# EAGLE design DKBLE112 IO Shield v1.0 (EAGLE 6.3)
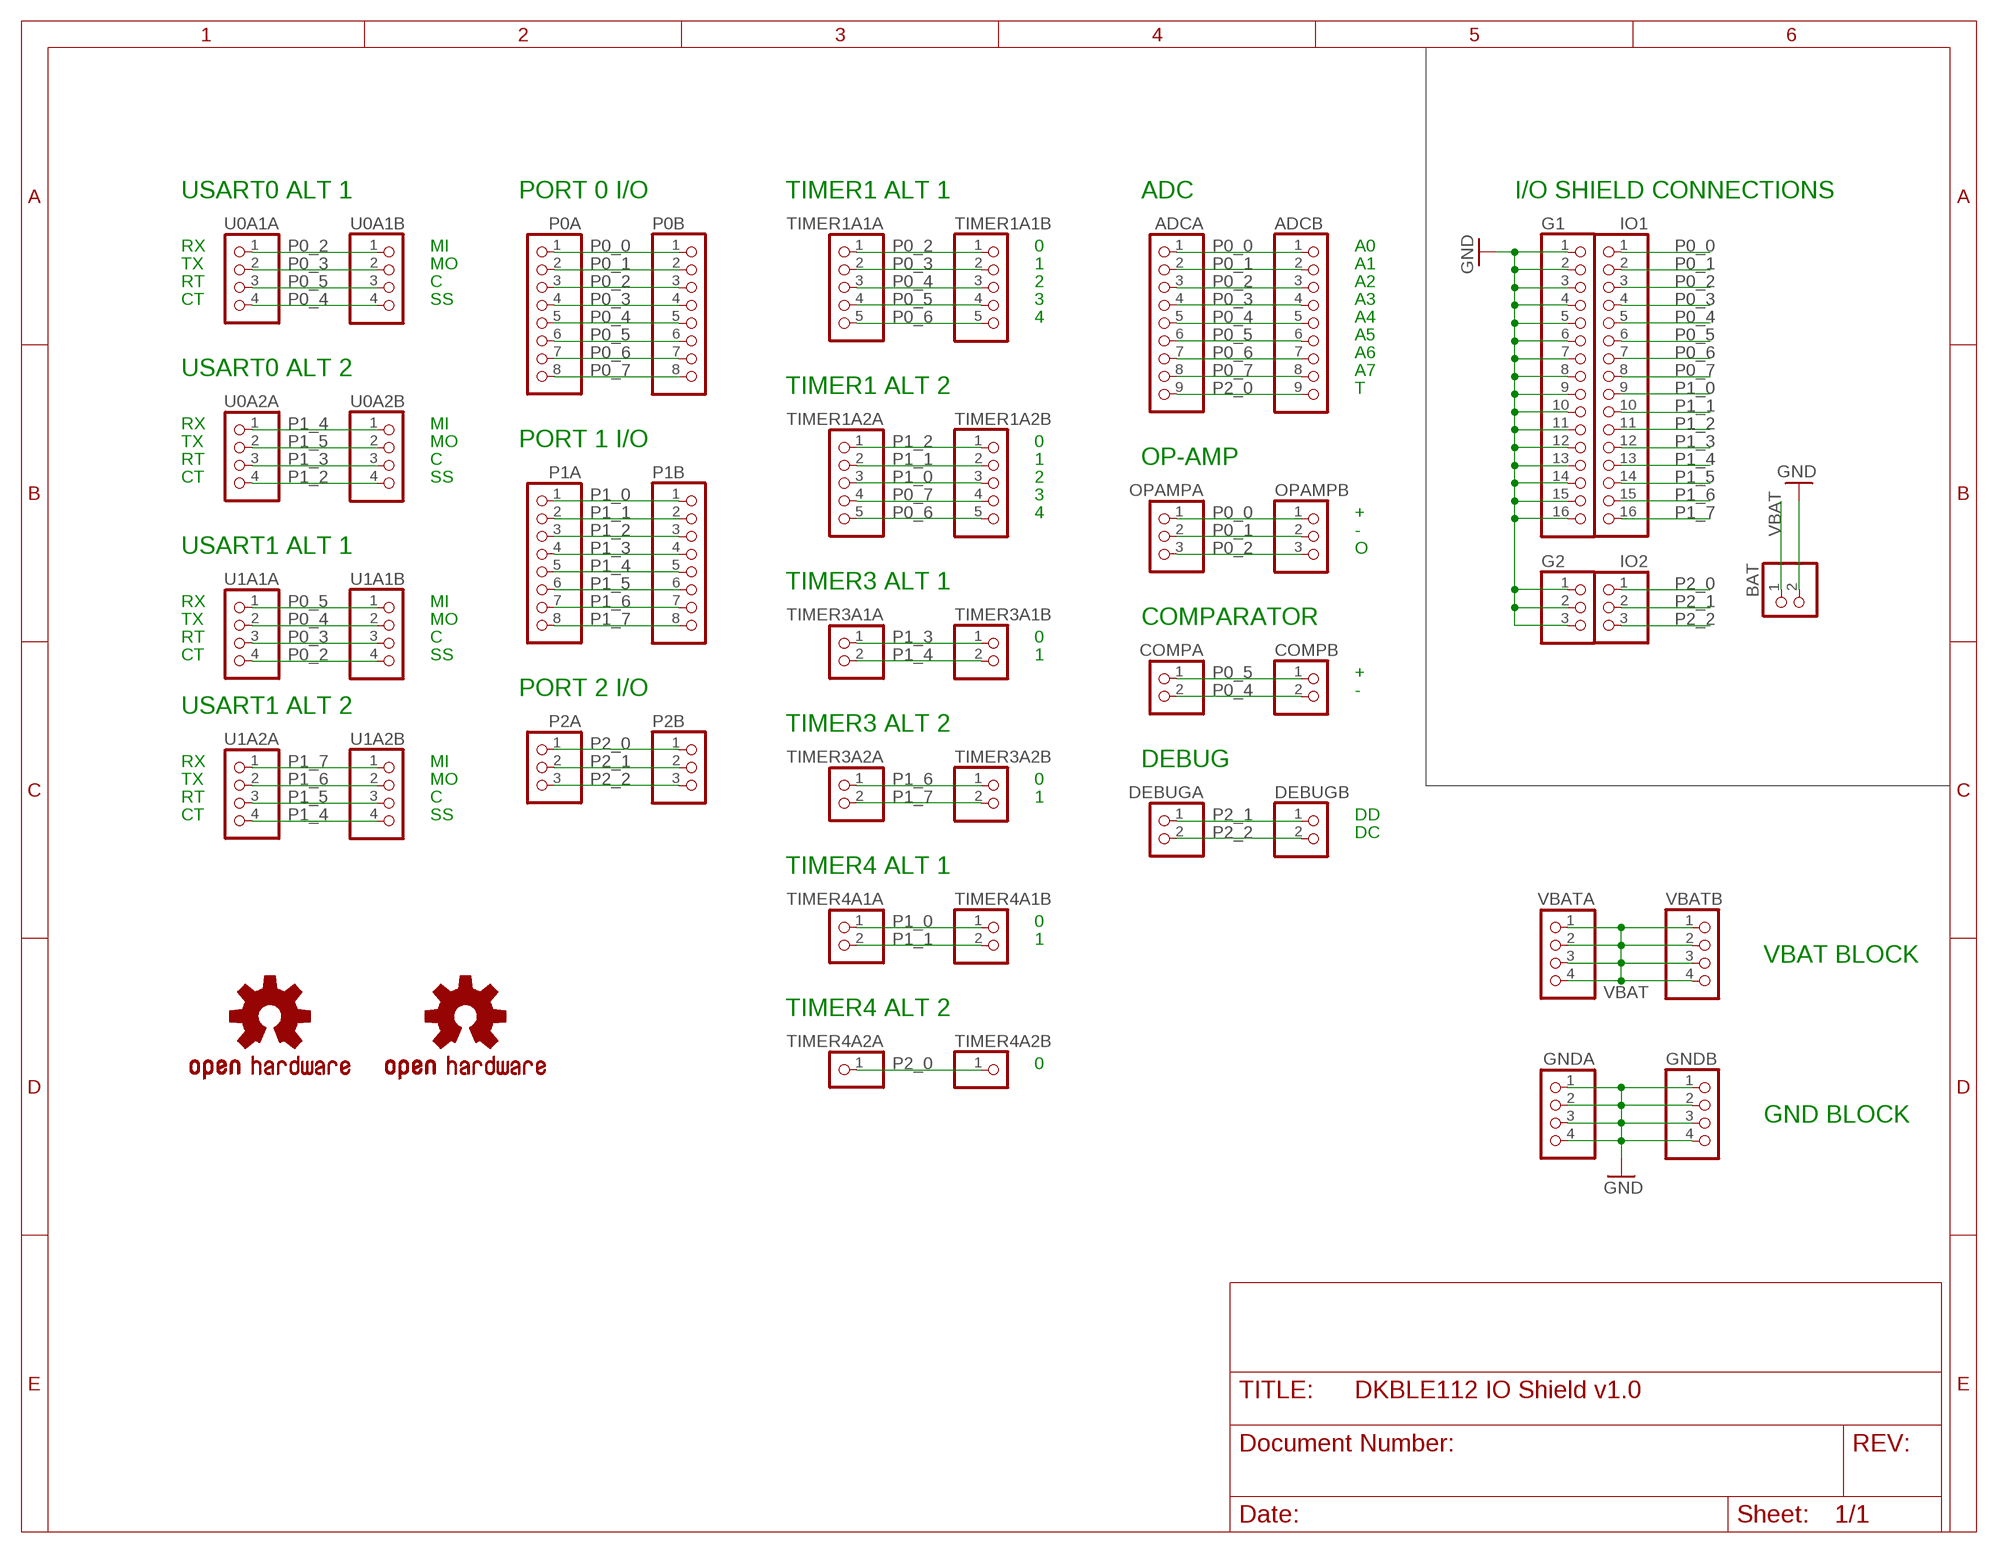
[diagram p0: schematic, sheet 1]

## Parts
ADCA  PINHD-1X9  [1X09]
ADCB  PINHD-1X9  [1X09]
BAT  PINHD-1X2  [1X02]
COMPA  PINHD-1X2  [1X02]
COMPB  PINHD-1X2  [1X02]
DEBUGA  PINHD-1X2  [1X02]
DEBUGB  PINHD-1X2  [1X02]
G1  PINHD-1X16  [1X16]
G2  PINHD-1X3  [1X03]
GNDA  PINHD-1X4  [1X04]
GNDB  PINHD-1X4  [1X04]
IO1  PINHD-1X16  [1X16]
IO2  PINHD-1X3  [1X03]
OPAMPA  PINHD-1X3  [1X03]
OPAMPB  PINHD-1X3  [1X03]
P0A  PINHD-1X8  [1X08]
P0B  PINHD-1X8  [1X08]
P1A  PINHD-1X8  [1X08]
P1B  PINHD-1X8  [1X08]
P2A  PINHD-1X3  [1X03]
P2B  PINHD-1X3  [1X03]
TIMER1A1A  PINHD-1X5  [1X05]
TIMER1A1B  PINHD-1X5  [1X05]
TIMER1A2A  PINHD-1X5  [1X05]
TIMER1A2B  PINHD-1X5  [1X05]
TIMER3A1A  PINHD-1X2  [1X02]
TIMER3A1B  PINHD-1X2  [1X02]
TIMER3A2A  PINHD-1X2  [1X02]
TIMER3A2B  PINHD-1X2  [1X02]
TIMER4A1A  PINHD-1X2  [1X02]
TIMER4A1B  PINHD-1X2  [1X02]
TIMER4A2A  PINHD-1X1  [1X01]
TIMER4A2B  PINHD-1X1  [1X01]
U0A1A  PINHD-1X4  [1X04]
U0A1B  PINHD-1X4  [1X04]
U0A2A  PINHD-1X4  [1X04]
U0A2B  PINHD-1X4  [1X04]
U1A1A  PINHD-1X4  [1X04]
U1A1B  PINHD-1X4  [1X04]
U1A2A  PINHD-1X4  [1X04]
U1A2B  PINHD-1X4  [1X04]
U$1  OSHW-LOGOL  [OSHW-LOGO-L]
U$2  OSHW-LOGOM  [OSHW-LOGO-M]
VBATA  PINHD-1X4  [1X04]
VBATB  PINHD-1X4  [1X04]

## Nets
GND: BAT.2 G1.1 G1.2 G1.3 G1.4 G1.5 G1.6 G1.7 G1.8 G1.9 G1.10 G1.11 G1.12 G1.13 G1.14 G1.15 G1.16 G2.1 G2.2 G2.3 GNDA.1 GNDA.2 GNDA.3 GNDA.4 GNDB.1 GNDB.2 GNDB.3 GNDB.4
P0_0: ADCA.1 ADCB.1 IO1.1 OPAMPA.1 OPAMPB.1 P0A.1 P0B.1
P0_1: ADCA.2 ADCB.2 IO1.2 OPAMPA.2 OPAMPB.2 P0A.2 P0B.2
P0_2: ADCA.3 ADCB.3 IO1.3 OPAMPA.3 OPAMPB.3 P0A.3 P0B.3 TIMER1A1A.1 TIMER1A1B.1 U0A1A.1 U0A1B.1 U1A1A.4 U1A1B.4
P0_3: ADCA.4 ADCB.4 IO1.4 P0A.4 P0B.4 TIMER1A1A.2 TIMER1A1B.2 U0A1A.2 U0A1B.2 U1A1A.3 U1A1B.3
P0_4: ADCA.5 ADCB.5 COMPA.2 COMPB.2 IO1.5 P0A.5 P0B.5 TIMER1A1A.3 TIMER1A1B.3 U0A1A.4 U0A1B.4 U1A1A.2 U1A1B.2
P0_5: ADCA.6 ADCB.6 COMPA.1 COMPB.1 IO1.6 P0A.6 P0B.6 TIMER1A1A.4 TIMER1A1B.4 U0A1A.3 U0A1B.3 U1A1A.1 U1A1B.1
P0_6: ADCA.7 ADCB.7 IO1.7 P0A.7 P0B.7 TIMER1A1A.5 TIMER1A1B.5 TIMER1A2A.5 TIMER1A2B.5
P0_7: ADCA.8 ADCB.8 IO1.8 P0A.8 P0B.8 TIMER1A2A.4 TIMER1A2B.4
P1_0: IO1.9 P1A.1 P1B.1 TIMER1A2A.3 TIMER1A2B.3 TIMER4A1A.1 TIMER4A1B.1
P1_1: IO1.10 P1A.2 P1B.2 TIMER1A2A.2 TIMER1A2B.2 TIMER4A1A.2 TIMER4A1B.2
P1_2: IO1.11 P1A.3 P1B.3 TIMER1A2A.1 TIMER1A2B.1 U0A2A.4 U0A2B.4
P1_3: IO1.12 P1A.4 P1B.4 TIMER3A1A.1 TIMER3A1B.1 U0A2A.3 U0A2B.3
P1_4: IO1.13 P1A.5 P1B.5 TIMER3A1A.2 TIMER3A1B.2 U0A2A.1 U0A2B.1 U1A2A.4 U1A2B.4
P1_5: IO1.14 P1A.6 P1B.6 U0A2A.2 U0A2B.2 U1A2A.3 U1A2B.3
P1_6: IO1.15 P1A.7 P1B.7 TIMER3A2A.1 TIMER3A2B.1 U1A2A.2 U1A2B.2
P1_7: IO1.16 P1A.8 P1B.8 TIMER3A2A.2 TIMER3A2B.2 U1A2A.1 U1A2B.1
P2_0: ADCA.9 ADCB.9 IO2.1 P2A.1 P2B.1 TIMER4A2A.1 TIMER4A2B.1
P2_1: DEBUGA.1 DEBUGB.1 IO2.2 P2A.2 P2B.2
P2_2: DEBUGA.2 DEBUGB.2 IO2.3 P2A.3 P2B.3
VBAT: BAT.1 VBATA.1 VBATA.2 VBATA.3 VBATA.4 VBATB.1 VBATB.2 VBATB.3 VBATB.4

## Notes on the sheet
- USART0 ALT 1 | PORT 0 I/O | TIMER1 ALT 1 | ADC | I/O SHIELD CONNECTIONS
- RX | MI | 0 | A0
- TX | MO | 1 | A1
- RT | C | 2 | A2
- CT | SS | 3 | A3
- 4 | A4
- A5
- A6
- USART0 ALT 2 | A7
- TIMER1 ALT 2 | T
- RX | MI
- TX | MO | PORT 1 I/O | 0
- RT | C | 1 | OP-AMP
- CT | SS | 2
- 3
- 4 | +
- -
- USART1 ALT 1 | O
- TIMER3 ALT 1
- RX | MI
- TX | MO | COMPARATOR
- RT | C | 0
- CT | SS | 1
- +
- PORT 2 I/O | -
- USART1 ALT 2
- TIMER3 ALT 2
- RX | MI | DEBUG
- TX | MO | 0
- RT | C | 1
- CT | SS | DD
- DC
- TIMER4 ALT 1
- 0
- 1
- VBAT BLOCK
- TIMER4 ALT 2
- 0
- GND BLOCK

## Library data of the parts
ADCA ADCB = sf-pinhead:PINHD-1X9: PIN HEADER
BAT COMPA COMPB DEBUGA DEBUGB TIMER3A1A TIMER3A1B TIMER3A2A TIMER3A2B TIMER4A1A TIMER4A1B = sf-pinhead:PINHD-1X2: PIN HEADER
G1 IO1 = sf-pinhead:PINHD-1X16: PIN HEADER
G2 IO2 OPAMPA OPAMPB P2A P2B = sf-pinhead:PINHD-1X3: PIN HEADER
GNDA GNDB U0A1A U0A1B U0A2A U0A2B U1A1A U1A1B U1A2A U1A2B VBATA VBATB = sf-pinhead:PINHD-1X4: PIN HEADER
P0A P0B P1A P1B = sf-pinhead:PINHD-1X8: PIN HEADER
TIMER1A1A TIMER1A1B TIMER1A2A TIMER1A2B = sf-pinhead:PINHD-1X5: PIN HEADER
TIMER4A2A TIMER4A2B = sf-pinhead:PINHD-1X1: PIN HEADER
U$1 U$2 = SparkFun:OSHW-LOGO: Open Source Hardware Logo This logo indicates the piece of hardware it is found on incorporates a OSHW license and/or adheres to the definition of open source hardware found here: http://freedomdefined.org/OSHW

## Board
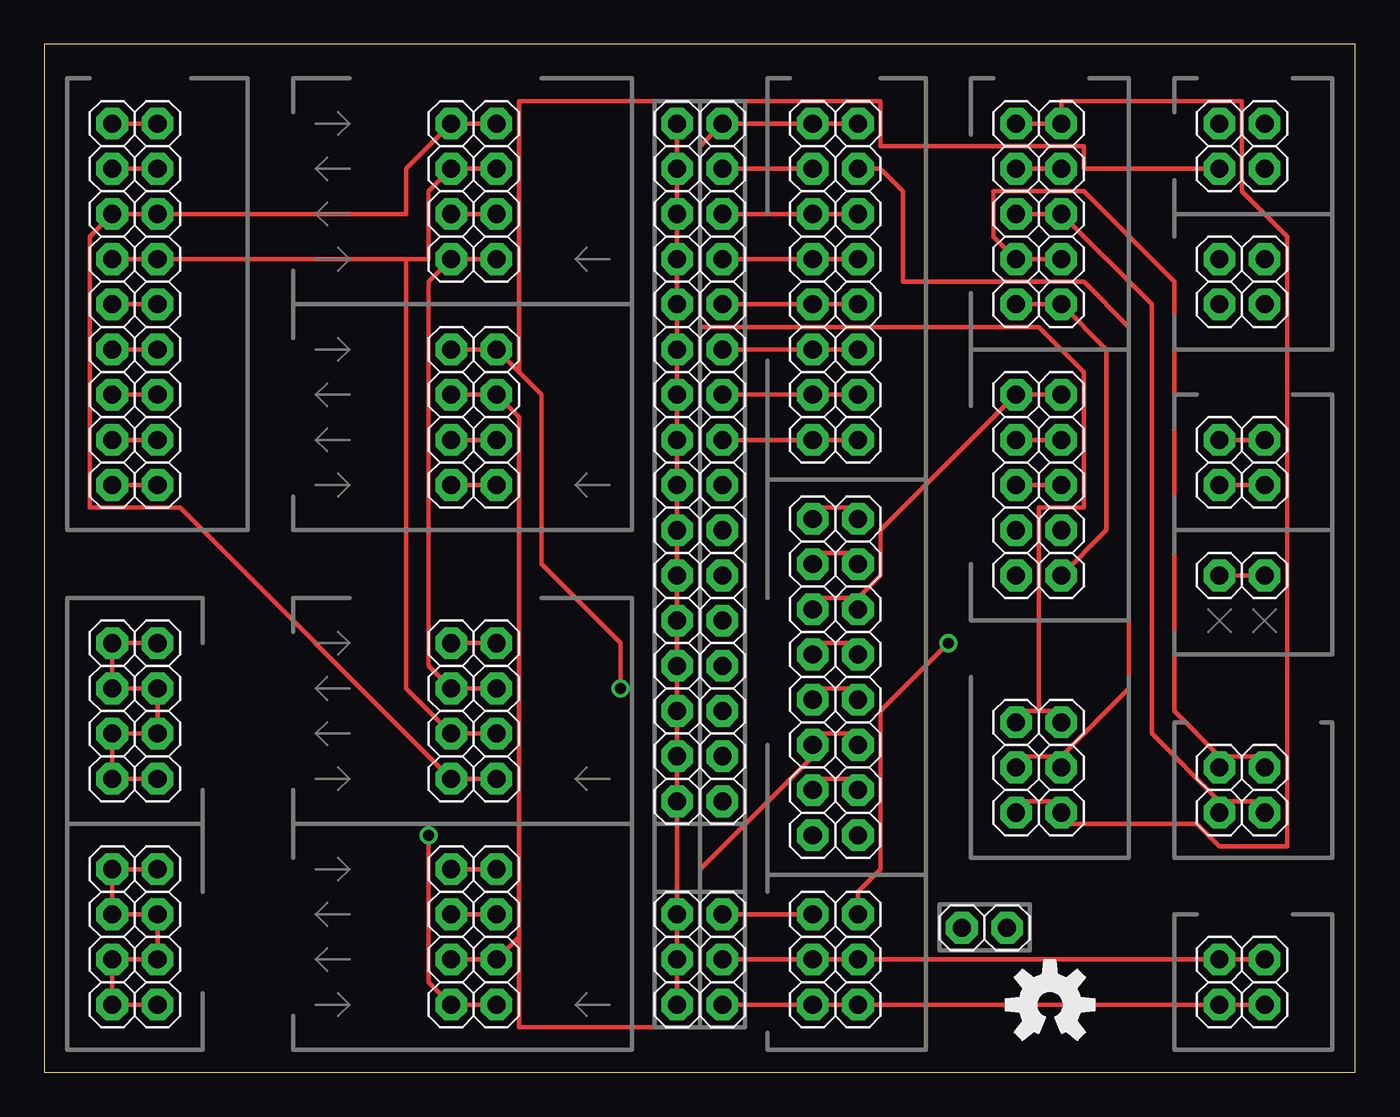
[diagram p1: board, top side]
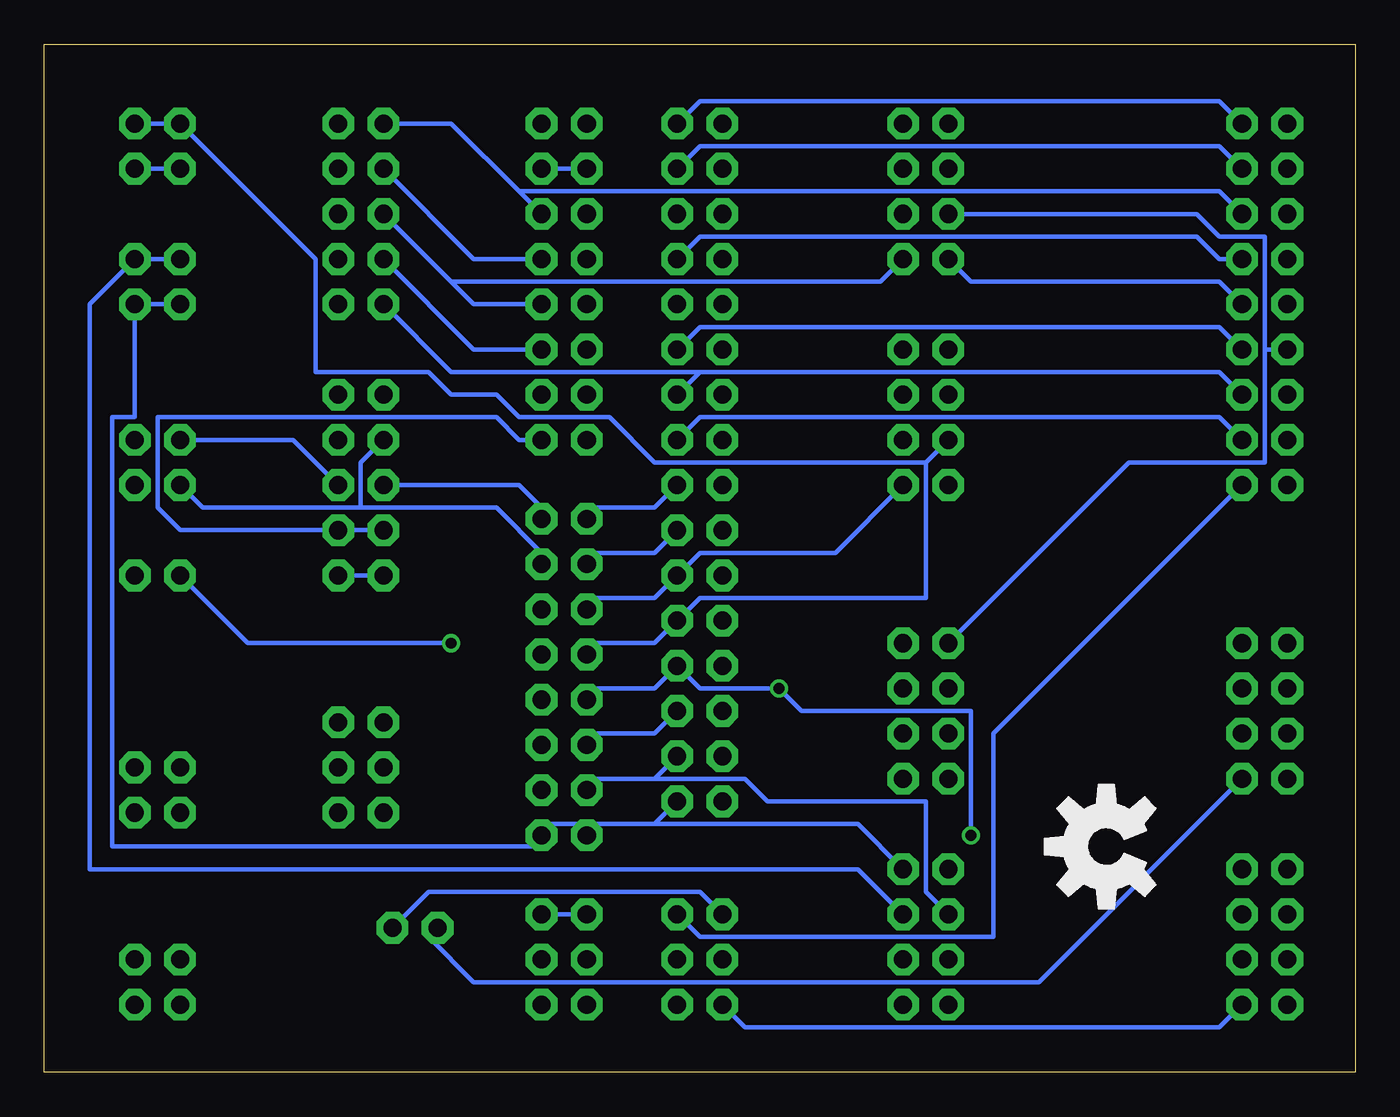
[diagram p2: board, bottom side, seen from below]

Size 73.66 x 57.78 mm. Coordinates in mm from the lower left corner, seen from the top.
Outline: 0,0 73.66,0 73.66,57.78 0,57.78 0,0
Copper layers (1*16): Top 0.035mm / dielectric 1.5mm / Bottom 0.035mm
Design rules "default": minimum track width 10mil, minimum drill 24mil, track to track 8mil, track to pad 8mil, pad to pad 8mil, via to via 8mil, smd to smd 8mil, copper to edge 40mil, drill to drill 8mil, minimum pad ring 10mil, minimum via ring 8mil, stop-mask expansion 4mil, vias tented up to drill 0mil, thermal gap 10mil

### Footprints (pad centres in the part's own frame; a part is rotated, then mirrored left to right if it is on the bottom)
1X09 = drill 1.016 pad 1.778 octagon: 1 -10.16,0; 2 -7.62,0; 3 -5.08,0; 4 -2.54,0; 5 0,0; 6 2.54,0; 7 5.08,0; 8 7.62,0; 9 10.16,0
1X02 = drill 1.016 pad 1.778 octagon: 1 -1.27,0; 2 1.27,0
1X16 = drill 1.016 pad 1.778 octagon: 1 -19.05,0; 2 -16.51,0; 3 -13.97,0; 4 -11.43,0; 5 -8.89,0; 6 -6.35,0; 7 -3.81,0; 8 -1.27,0; 9 1.27,0; 10 3.81,0; 11 6.35,0; 12 8.89,0; 13 11.43,0; 14 13.97,0; 15 16.51,0; 16 19.05,0
1X03 = drill 1.016 pad 1.778 octagon: 1 -2.54,0; 2 0,0; 3 2.54,0
1X04 = drill 1.016 pad 1.778 octagon: 1 -3.81,0; 2 -1.27,0; 3 1.27,0; 4 3.81,0
1X08 = drill 1.016 pad 1.778 octagon: 1 -8.89,0; 2 -6.35,0; 3 -3.81,0; 4 -1.27,0; 5 1.27,0; 6 3.81,0; 7 6.35,0; 8 8.89,0
1X05 = drill 1.016 pad 1.778 octagon: 1 -5.08,0; 2 -2.54,0; 3 0,0; 4 2.54,0; 5 5.08,0
1X01 = drill 1.016 pad 1.778 octagon: 1 0,0

### Placement (x,y rotation side)
ADCA  3.81,43.18 270 top
ADCB  6.35,43.18 270 top
BAT  52.83,8.13 0 top
COMPA  66.04,15.88 270 top
COMPB  68.58,15.88 270 top
DEBUGA  66.04,5.08 270 top
DEBUGB  68.58,5.08 270 top
G1  35.56,34.29 270 top
G2  35.56,6.35 270 top
GNDA  3.81,7.62 90 top
GNDB  6.35,7.62 90 top
IO1  38.1,34.29 270 top
IO2  38.1,6.35 270 top
OPAMPA  54.61,17.14 270 top
OPAMPB  57.15,17.14 270 top
P0A  43.18,44.45 270 top
P0B  45.72,44.45 270 top
P1A  43.18,22.23 270 top
P1B  45.72,22.23 270 top
P2A  43.18,6.35 270 top
P2B  45.72,6.35 270 top
TIMER1A1A  54.61,48.26 270 top
TIMER1A1B  57.15,48.26 270 top
TIMER1A2A  54.61,33.02 270 top
TIMER1A2B  57.15,33.02 270 top
TIMER3A1A  66.04,52.07 270 top
TIMER3A1B  68.58,52.07 270 top
TIMER3A2A  66.04,44.45 270 top
TIMER3A2B  68.58,44.45 270 top
TIMER4A1A  66.04,34.29 270 top
TIMER4A1B  68.58,34.29 270 top
TIMER4A2A  66.04,27.94 90 top
TIMER4A2B  68.58,27.94 90 top
U0A1A  25.4,49.53 270 top
U0A1B  22.86,49.53 270 top
U0A2A  25.4,36.83 270 top
U0A2B  22.86,36.83 270 top
U1A1A  25.4,20.32 270 top
U1A1B  22.86,20.32 270 top
U1A2A  25.4,7.62 270 top
U1A2B  22.86,7.62 270 top
U$1  13.97,12.7 90 bottom
U$2  56.52,3.81 0 top
VBATA  3.81,20.32 90 top
VBATB  6.35,20.32 90 top

### Tracks (layer width: path | path; a pad name or v marks a point on that pad's centre or on a via)
GND
  Top 0.254: G1.1 G1.2 G1.3 G1.4 G1.5 G1.6 G1.7 G1.8 G1.9 G1.10 G1.11 G1.12 G1.13 G1.14 G1.15 G1.16 G2.1 G2.2 G2.3 | GNDB.1 GNDA.1 GNDA.2 GNDB.2 GNDB.3 GNDA.3 GNDA.4 GNDB.4
  Bottom 0.254: G2.1 36.83,10.16 52.07,10.16 BAT.2 54.61,7.62 | GNDB.1 7.62,2.54 34.29,2.54 G2.3
P0_0
  Top 0.254: ADCB.1 ADCA.1 | 55.88,20.32 57.15,20.32 OPAMPB.1 | 55.88,20.32 54.61,20.32 OPAMPA.1 | P0B.1 P0A.1 IO1.1 36.83,52.07 36.83,41.91 55.88,41.91 58.42,39.37 58.42,31.75 55.88,31.75 55.88,20.32
  Bottom 0.254: ADCB.1 7.62,54.61 36.83,54.61 IO1.1
P0_1
  Top 0.254: ADCB.2 ADCA.2 | 57.15,17.78 54.61,17.78 OPAMPA.2 | P0A.2 IO1.2 | 57.15,17.78 60.96,21.59 60.96,41.91 58.42,44.45 48.26,44.45 48.26,49.53 46.99,50.8 P0B.2 | 57.15,17.78 OPAMPB.2
  Bottom 0.254: P0A.2 P0B.2 | ADCB.2 7.62,52.07 36.83,52.07 IO1.2
P0_2
  Top 0.254: U1A1A.4 U1A1B.4 7.62,31.75 2.54,31.75 2.54,46.99 ADCA.3 ADCB.3 20.32,48.26 20.32,50.8 U0A1B.1 U0A1A.1 | IO1.3 P0A.3 P0B.3 | OPAMPA.3 54.61,15.24 57.15,15.24 OPAMPB.3 57.15,13.97 64.77,13.97 66.04,12.7 69.85,12.7 69.85,46.99 67.31,49.53 67.31,54.61 57.15,54.61 TIMER1A1B.1 TIMER1A1A.1
  Bottom 0.254: 46.99,49.53 50.8,53.34 TIMER1A1A.1 | 46.99,49.53 P0B.3 | ADCB.3 7.62,49.53 46.99,49.53
P0_3
  Top 0.254: TIMER1A1B.2 TIMER1A1A.2 | IO1.4 P0A.4 P0B.4 | U1A1A.3 U1A1B.3 20.32,21.59 20.32,45.72 | ADCA.4 ADCB.4 20.32,45.72 | U0A1A.2 U0A1B.2 21.59,49.53 21.59,45.72 20.32,45.72
  Bottom 0.254: TIMER1A1A.2 49.53,45.72 P0B.4 | IO1.4 36.83,46.99 8.89,46.99 7.62,45.72 ADCB.4
P0_4
  Top 0.254: ADCB.5 ADCA.5 | U1A1A.2 U1A1B.2 21.59,22.86 21.59,44.45 U0A1B.4 U0A1A.4 | 66.04,15.24 68.58,15.24 COMPB.2 | TIMER1A1A.3 TIMER1A1B.3 62.23,43.18 62.23,19.05 66.04,15.24 | IO1.5 P0A.5 P0B.5 | 66.04,15.24 COMPA.2
  Bottom 0.254: ADCB.5 7.62,44.45 21.59,44.45 U0A1B.4 | 50.8,44.45 49.53,43.18 P0B.5 | 50.8,44.45 TIMER1A1A.3 | U0A1A.4 26.67,44.45 50.8,44.45
P0_5
  Top 0.254: U0A1A.3 U0A1B.3 | 66.04,17.78 68.58,17.78 COMPB.1 | TIMER1A1B.4 TIMER1A1A.4 53.34,46.99 53.34,49.53 58.42,49.53 63.5,44.45 63.5,20.32 66.04,17.78 | U1A1A.1 U1A1B.1 | ADCB.6 ADCA.6 | IO1.6 P0A.6 P0B.6 | 66.04,17.78 COMPA.1
  Bottom 0.254: ADCB.6 7.62,41.91 36.83,41.91 IO1.6 | U1A1B.1 12.7,34.29 5.08,34.29 5.08,40.64 | ADCA.6 5.08,40.64 | TIMER1A1A.4 49.53,40.64 P0B.6 | U0A1B.3 8.89,48.26 7.62,46.99 5.08,46.99 5.08,40.64
P0_6
  Top 0.254: TIMER1A1A.5 TIMER1A1B.5 59.69,40.64 59.69,30.48 TIMER1A2B.5 | ADCB.7 ADCA.7 | IO1.7 P0A.7 P0B.7
  Bottom 0.254: TIMER1A2B.5 TIMER1A2A.5 | ADCB.7 7.62,39.37 36.83,39.37 | IO1.7 36.83,39.37 | TIMER1A1A.5 50.8,39.37 36.83,39.37
P0_7
  Top 0.254: ADCB.8 ADCA.8 | IO1.8 P0A.8 P0B.8
  Bottom 0.254: TIMER1A2A.4 TIMER1A2B.4 66.04,30.48 67.31,31.75 67.31,36.83 48.26,36.83 46.99,35.56 P0B.8 | ADCB.8 7.62,36.83 36.83,36.83 IO1.8
P1_0
  Top 0.254: P1A.1 43.18,31.75 45.72,31.75 P1B.1 | TIMER1A2B.3 TIMER1A2A.3 | TIMER4A1B.1 TIMER4A1A.1
  Bottom 0.254: IO1.9 39.37,31.75 43.18,31.75 P1A.1 | TIMER1A2B.3 59.69,35.56 TIMER4A1A.1 | TIMER1A2A.3 46.99,33.02 45.72,31.75 P1B.1
P1_1
  Top 0.254: P1A.2 43.18,29.21 45.72,29.21 P1B.2 | TIMER1A2B.2 TIMER1A2A.2 | TIMER4A1B.2 TIMER4A1A.2
  Bottom 0.254: IO1.10 39.37,29.21 43.18,29.21 P1A.2 | TIMER1A2A.2 55.88,34.29 55.88,31.75 | 55.88,31.75 64.77,31.75 TIMER4A1A.2 | 55.88,31.75 48.26,31.75 45.72,29.21 P1B.2
P1_2
  Top 0.254: TIMER1A2B.1 TIMER1A2A.1 46.99,30.48 46.99,27.94 45.72,26.67 | U0A2A.4 U0A2B.4 | 45.72,26.67 43.18,26.67 P1A.3 | 45.72,26.67 P1B.3
  Bottom 0.254: P1A.3 43.18,26.67 39.37,26.67 IO1.11 36.83,29.21 29.21,29.21 U0A2A.4
P1_3
  Top 0.254: U0A2A.3 U0A2B.3 | P1A.4 43.18,24.13 45.72,24.13 P1B.4
  Bottom 0.254: TIMER3A1B.1 TIMER3A1A.1 58.42,45.72 58.42,39.37 52.07,39.37 50.8,38.1 48.26,38.1 46.99,36.83 41.91,36.83 39.37,34.29 24.13,34.29 | P1A.4 43.18,24.13 39.37,24.13 IO1.12 36.83,26.67 24.13,26.67 24.13,34.29 | 24.13,34.29 U0A2B.3
P1_4  (via drill 0.61)
  Top 0.254: U0A2B.1 U0A2A.1 26.67,39.37 | U1A2A.4 U1A2B.4 21.59,5.08 v21.59,13.34 | P1A.5 43.18,21.59 45.72,21.59 P1B.5 | 26.67,39.37 27.94,38.1 27.94,28.57 32.38,24.13 v32.38,21.59 | TIMER3A1A.2 58.42,50.8 58.42,52.07 46.99,52.07 46.99,54.61 26.67,54.61 26.67,39.37
  Bottom 0.254: TIMER3A1B.2 TIMER3A1A.2 | v21.59,13.34 21.59,20.32 31.11,20.32 v32.38,21.59 36.83,21.59 IO1.13 39.37,21.59 43.18,21.59 P1A.5
P1_5
  Top 0.254: P1B.6 45.72,19.05 43.18,19.05 P1A.6 43.18,17.78 36.83,11.43 36.83,2.54 26.67,2.54 26.67,7.62 | U1A2B.3 U1A2A.3 26.67,7.62 | U0A2B.2 U0A2A.2 26.67,36.83 26.67,7.62
  Bottom 0.254: IO1.14 39.37,19.05 43.18,19.05 P1A.6
P1_6
  Top 0.254: U1A2A.2 U1A2B.2 | P1A.7 43.18,16.51 45.72,16.51 P1B.7
  Bottom 0.254: TIMER3A2A.1 TIMER3A2B.1 71.12,43.18 71.12,11.43 27.94,11.43 U1A2A.2 | 39.37,16.51 IO1.15 | 39.37,16.51 43.18,16.51 P1A.7 | U1A2B.2 24.13,10.16 24.13,15.24 33.02,15.24 34.29,16.51 39.37,16.51
P1_7
  Top 0.254: U1A2A.1 U1A2B.1
  Bottom 0.254: TIMER3A2A.2 TIMER3A2B.2 68.58,36.83 69.85,36.83 69.85,12.7 45.72,12.7 P1B.8 45.72,13.97 43.18,13.97 | 39.37,13.97 IO1.16 | 43.18,13.97 39.37,13.97 | 43.18,13.97 P1A.8 | U1A2A.1 27.94,13.97 39.37,13.97
P2_0  (via drill 0.61)
  Top 0.254: TIMER4A2B.1 TIMER4A2A.1 | ADCB.9 ADCA.9 | P2A.1 IO2.1 | v50.8,24.13 46.99,20.32 46.99,11.43 45.72,10.16 P2B.1
  Bottom 0.254: P2A.1 P2B.1 | ADCB.9 20.32,19.05 20.32,7.62 36.83,7.62 IO2.1 | TIMER4A2A.1 62.23,24.13 v50.8,24.13
P2_1
  Top 0.254: DEBUGB.1 DEBUGA.1 P2B.2 P2A.2 IO2.2
P2_2
  Top 0.254: DEBUGB.2 DEBUGA.2 P2B.3 P2A.3 IO2.3
VBAT
  Top 0.254: VBATB.4 VBATA.4 VBATA.3 VBATB.3 VBATB.2 VBATA.2 VBATA.1 VBATB.1
  Bottom 0.254: VBATB.1 17.78,5.08 49.53,5.08 52.07,7.62 BAT.1

### Text on the board
tDocu: ADC | USART0 | I/O | TM1 | TM3 | A0 | RXD | MISO | 0 | 0 | 0 | A1 | A1 | TXD | MOSI | 1 | 1 | 1 | A2 | RTS | SCK | 2 | 2 | ALT 1 | A3 | CTS | SS | 3 | 3 | 0 | ALT 1 | A4 | 4 | 4 | A2 | 1 | PORT 0 | A5 | RXD | MISO | 0 | A6 | TXD | MOSI | 1 | 0 | TM4 | A7 | RTS | SCK | 2 | 1 | 0 | ALT 2 | A1 | T | CTS | SS | 2 | 1 | 0 | 3 | ALT 2 | 1 | 4 | 0 | USART1 | 2 | A2 | 1 | VBAT | RXD | MISO | 3 | OPAMP | TXD | MOSI | 4 | PORT 1 | + | COMP | RTS | SCK | 3 | ALT 1 | - | + | CTS | SS | 4 | O | - | 3 | RXD | MISO | GND | TXD | MOSI | 0 | DBG | RTS | SCK | 1 | D | ALT 2 | CTS | SS | PORT 2 | 2 | C
bDocu: sectorfej.net | DKBLE112 IO Shield v1.0